# Altium schematic sheet CAN.SchDoc
size 209 x 297 mm; _Razrabotal: {Разработал}; _Proveril: {Проверил}; _TKontr: {Т.контр}; _NKontr: {Н.контр}; _Utverdil: {Утвердил}
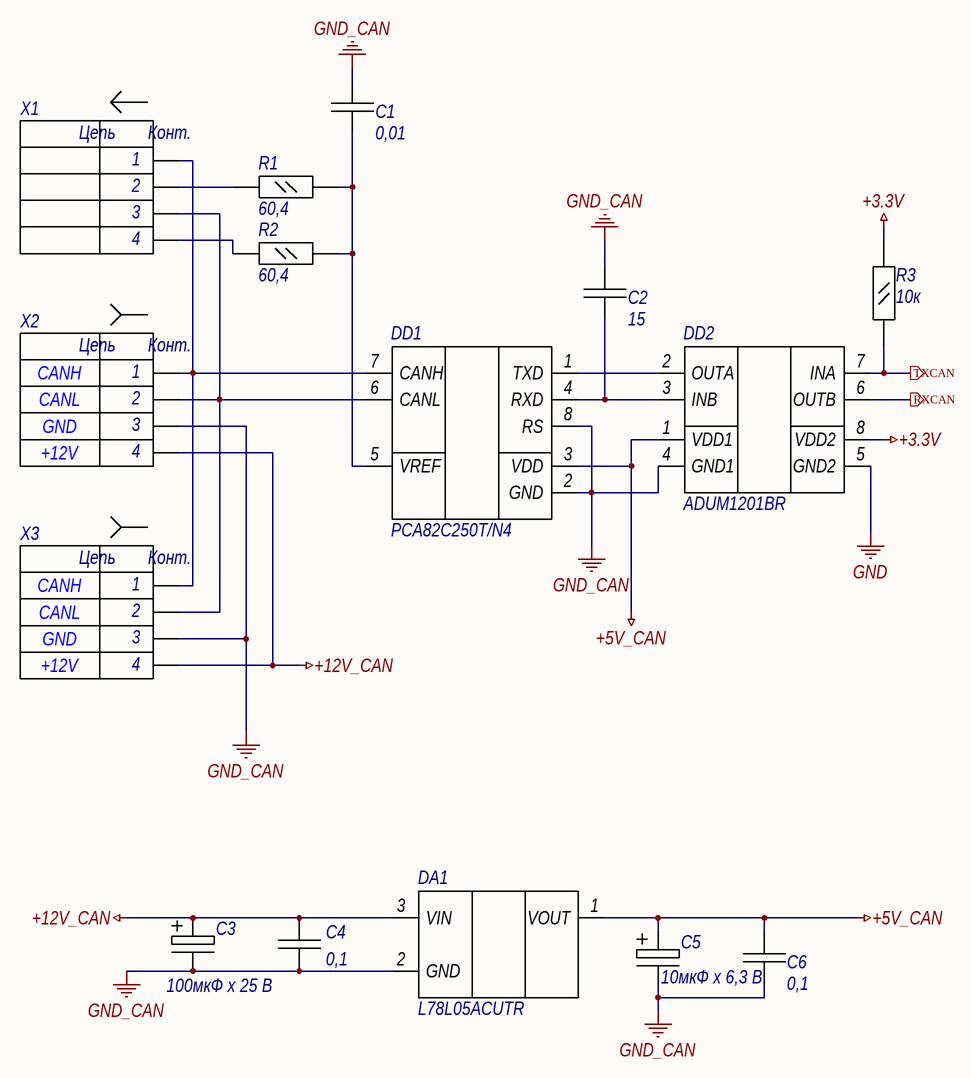
[diagram p0: CAN.SchDoc]

## Parts
C1  0,01  [0805]
C2  15  [0805]
C3  100мкФ x 25 В  [C_D5/F2.0_V]
C4  0,1  [0805]
C5  10мкФ x 6,3 В  [CAP_TYPE_A]
C6  0,1  [0805]
DA1  L78L05ACUTR  [SOT-89]
DD1  PCA82C250T/N4  [SO-8]
DD2  ADUM1201BR  [SO-8]
R1  60,4  [0805]
R2  60,4  [0805]
R3  10к  [0805]
X1  PLD-4  [PLD-4]  (value not drawn)
X2  TJ3-4P4C  [TJ3-4P4C]  (value not drawn)
X3  TJ3-4P4C  [TJ3-4P4C]  (value not drawn)

## Ports
RXCAN, TXCAN

## Nets
+3.3V: DD2.8(VDD2) R3.2
+5V_CAN: C5.1 C6.1 DA1.1(VOUT) DD1.3(VDD) DD2.1(VDD1)
+12V_CAN: C3.1 C4.1 DA1.3(VIN) X2.4 X3.4
GND: DD2.5(GND2)
GND_CAN: C1.2 C2.2 C3.2 C4.2 C5.2 C6.2 DA1.2(GND) DD1.2(GND) DD1.8(RS) DD2.4(GND1) X2.3 X3.3
RXCAN: DD2.6(OUTB) ; port RXCAN
TXCAN: DD2.7(INA) R3.1 ; port TXCAN
NetC1_1: C1.1 DD1.5(VREF) R1.2 R2.2
NetC2_1: C2.1 DD1.4(RXD) DD2.3(INB)
NetDD1_1: DD1.1(TXD) DD2.2(OUTA)
NetDD1_6: DD1.6(CANL) X1.3 X2.2 X3.2
NetDD1_7: DD1.7(CANH) X1.1 X2.1 X3.1
NetR1_1: R1.1 X1.2
NetR2_1: R2.1 X1.4

## Notes on the sheet
- CANH
- CANL
- GND
- +12V
- Перв. примен.
- Справ. №
- Подп. и дата
- Инв.№ дубл.
- Взам. инв.№
- Инв. № подп.
- Лист
- Изм.
- № докум.
- Подпись
- Дата
- Копировал
- Формат      А4
- (in symbol PLD-4) Цепь; Конт.
- (in symbol TJ3-4P4C) Цепь; Конт.

## Library data of the parts
C1 C2 C4 C6 = CC0805: Конденсатор; Manufacturer: YAGEO; Accuracy: 10%; CVoltage: 50 В; TC Material: X7R; ComponentName: СС0805; PackageName: 0805; ComponentType: Конденсатор
  C1: Value: 0,01
  C2: Value: 15
  C4 C6: Value: 0,1
C3 = CAP_RADIAL: Выводные электролитические конденсаторы; Manufacturer: HITANO; Accuracy: 20%; CVoltage: 25 В; ComponentName: ECR; ComponentType: Конденсатор электролитический; Value: 100мкФ
C5 = TANTAL_A: Manufacturer: Vishay; Accuracy: 20%; CVoltage: 6,3 В; ComponentName: 293D; PackageName: Тип A; ComponentType: Конденсатор электролитический танталовый; Value: 10мкФ
DA1 = L78L05ACU: Линейный стабилизатор напряжения; Manufacturer: STM; PackageName: SOT-89; ComponentType: Микросхема; ComponentName: L78L05ACUTR
DD1 = PCA82C250T: Интерфейс физического уровня CAN; Manufacturer: NXP; PackageName: SO-8; ComponentType: Микросхема; ComponentName: PCA82C250T/N4
DD2 = ADUM1201: Изолятор цифрового сигнала; Manufacturer: Analog Dev.; PackageName: SO-8; ComponentType: Микросхема; ComponentName: ADUM1201BR
R1-R3 = RC0805JR: Резистор общего назначения 5%; Manufacturer: YAGEO; PackageName: 0805; ComponentType: Резистор; Accuracy: 5%; ComponentName: RC0805JR
  R1 R2: Value: 60,4
  R3: Value: 10к
X1 = PLD-4: Разъем, вилка на плату двухрядная, шаг 2.54мм; ComponentType: Разъем; ComponentName: PLD-4
X2 X3 = TJ3-4P4C: Разъем, гнездо на плату, прямой; ComponentType: Разъем; ComponentName: TJ3-4P4C